# EAGLE design MJ818 clone - all driver - prod (EAGLE 9.6.2)
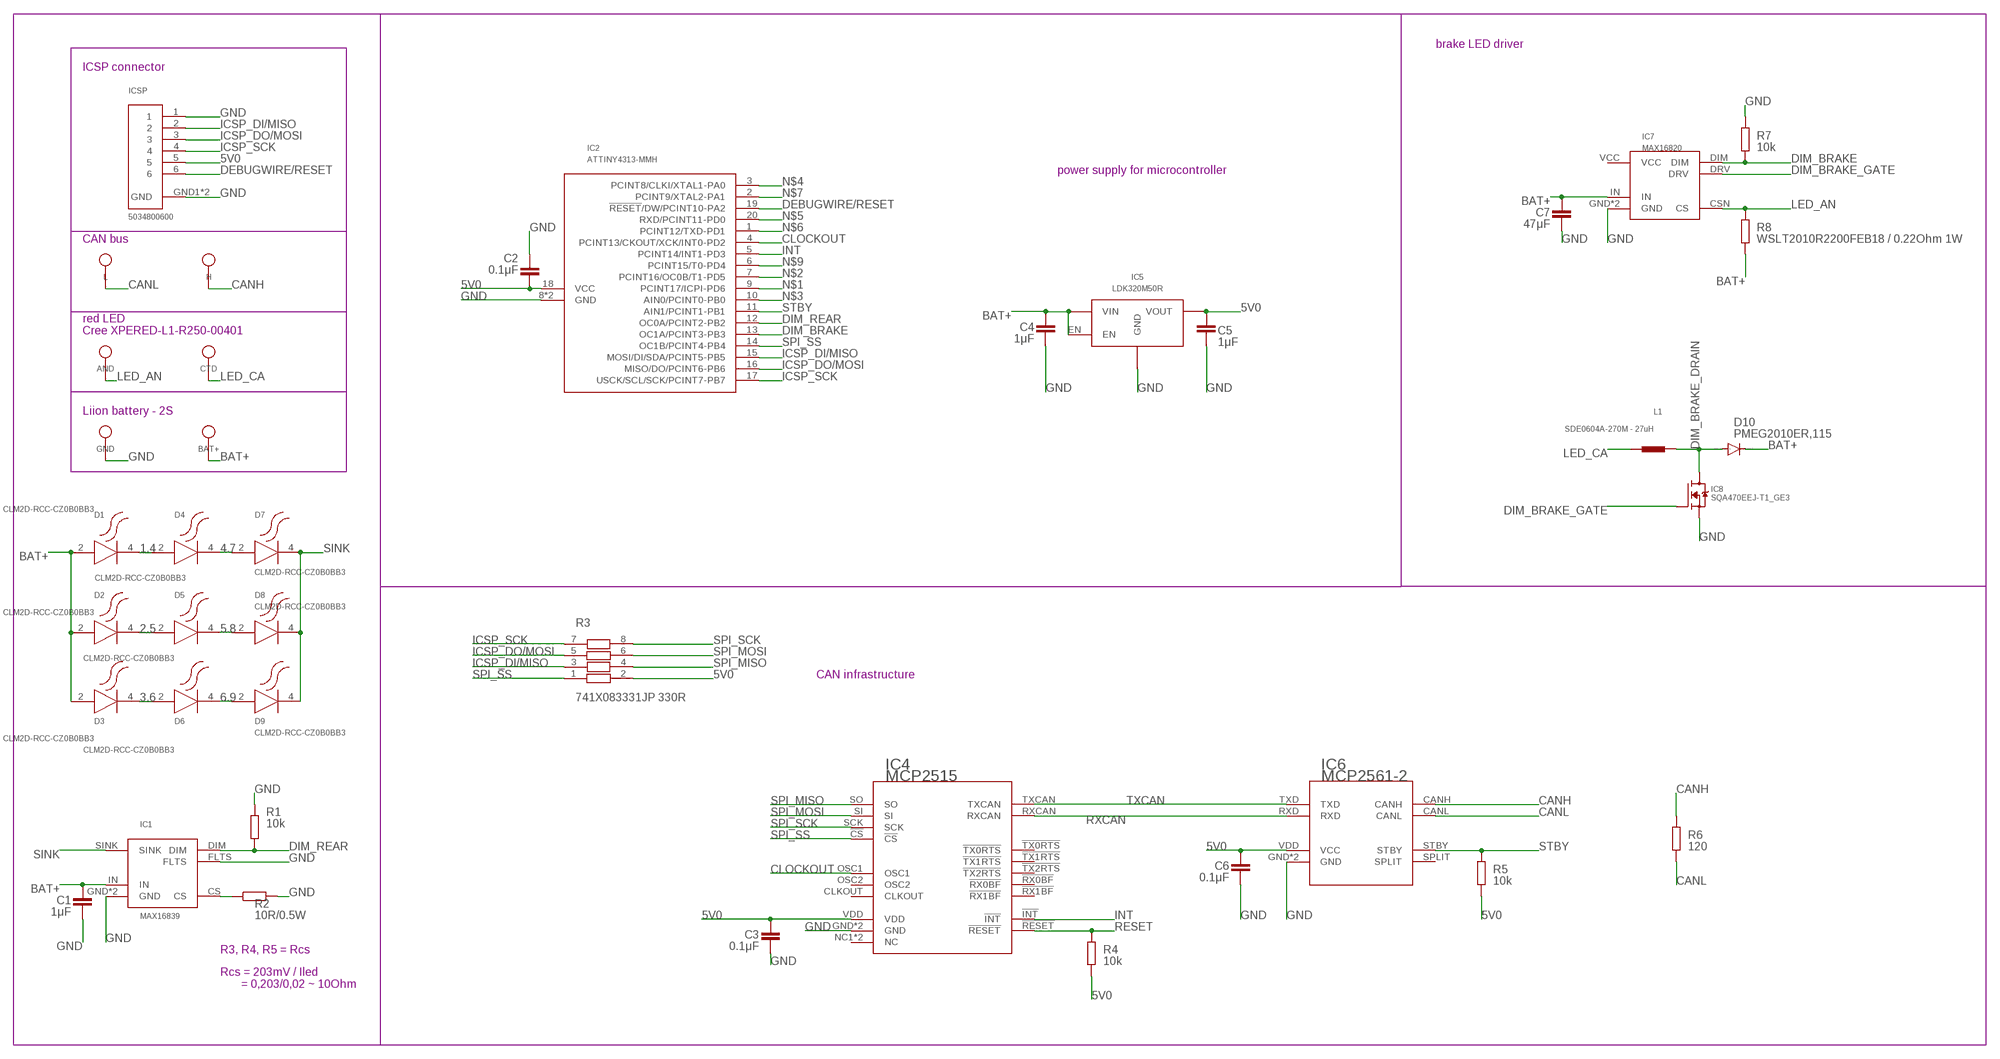
[diagram p0: schematic, sheet 1]

## Parts
AND  LED anode  TPSMT-1.2MM  [SMT-1.2MM]
BAT+  bat+  TPTH-1.2MM  [TH-1.2MM]
C1  1μF  C-EUC0402  [C0402]
C2  0.1μF  C-EUC0402  [C0402]
C3  0.1μF  C-EUC0402  [C0402]
C4  1μF  C-EUC0402  [C0402]
C5  1μF  C-EUC0402  [C0402]
C6  0.1μF  C-EUC0402  [C0402]
C7  47μF  C-EUC1206  [C1206]
CTD  LED cathode  TPSMT-1.2MM  [SMT-1.2MM]
D1  CLM2D-RCC-CZ0B0BB3  1374-CLM2D-RCC-ACC-1064252  [SMD]
D2  CLM2D-RCC-CZ0B0BB3  1374-CLM2D-RCC-ACC-1064252  [SMD]
D3  CLM2D-RCC-CZ0B0BB3  1374-CLM2D-RCC-ACC-1064252  [SMD]
D4  CLM2D-RCC-CZ0B0BB3  1374-CLM2D-RCC-ACC-1064252  [SMD]
D5  CLM2D-RCC-CZ0B0BB3  1374-CLM2D-RCC-ACC-1064252  [SMD]
D6  CLM2D-RCC-CZ0B0BB3  1374-CLM2D-RCC-ACC-1064252  [SMD]
D7  CLM2D-RCC-CZ0B0BB3  1374-CLM2D-RCC-ACC-1064252  [SMD]
D8  CLM2D-RCC-CZ0B0BB3  1374-CLM2D-RCC-ACC-1064252  [SMD]
D9  CLM2D-RCC-CZ0B0BB3  1374-CLM2D-RCC-ACC-1064252  [SMD]
D10  PMEG2010ER,115  DIODE-SOD123  [SOD123]
GND  gnd  TPTH-1.2MM  [TH-1.2MM]
H  LED anode  TPTH-1.2MM  [TH-1.2MM]
IC1  MAX16839  MAX16839  [TDFN-6-EP]
IC2  ATTINY4313-MMH  ATTINY4313VQFN-20  [VQFN-20]
IC4  MCP2515  MCP2515-I-ML  [QFN20]
IC5  LDK320M50R  LDK320SOT-23-5L  [SOT-23-5L]
IC6  MCP2561-2  [DFN10]
IC7  MAX16820  [TDFN-6-EP]
IC8  SQA470EEJ-T1_GE3  SIA456DJ  [SC-70-6]
ICSP  5034800600  [SMT]
L  LED anode  TPTH-1.2MM  [TH-1.2MM]
L1  SDE0604A-270M - 27uH  DE0604A-778075  [SMT]
R1  10k  R-EU_R0402  [R0402]
R2  10R/0.5W  R-EU_R0603  [R0603]
R3  741X083331JP 330R  741X083331JP  [0402]
R4  10k  R-EU_R0402  [R0402]
R5  10k  R-EU_R0402  [R0402]
R6  120  R-EU_R0805  [R0805]
R7  10k  R-EU_R0402  [R0402]
R8  WSLT2010R2200FEB18 / 0.22Ohm 1W  R-EU_R2010  [R2010]

## Nets
1.4 [currett-0.25mA]: D1.4(C) D4.2(A)
2.5 [currett-0.25mA]: D2.4(C) D5.2(A)
3.6 [currett-0.25mA]: D3.4(C) D6.2(A)
4.7 [currett-0.25mA]: D4.4(C) D7.2(A)
5.8 [currett-0.25mA]: D5.4(C) D8.2(A)
5V0 [VCC]: C2.1 C3.1 C5.2 C6.1 IC2.18(VCC) IC4.VDD IC5.OUT(VOUT) IC6.VDD(VCC) ICSP.5 R3.2 R4.1 R5.1
6.9 [currett-0.25mA]: D6.4(C) D9.2(A)
BAT+ [currett-0.25mA]: BAT+.TP$1 C1.2 C4.1 C7.1 D1.2(A) D2.2(A) D3.2(A) D10.C IC1.IN IC5.EN IC5.IN(VIN) IC7.IN R8.2
CANH [signal]: H.TP$1 IC6.CANH R6.2
CANL [signal]: IC6.CANL L.TP$1 R6.1
CLOCKOUT [signal_internal]: IC2.4(PCINT13/CKOUT/XCK/INT0-PD2) IC4.OSC1
CS [signal]: IC1.CS R2.1
DEBUGWIRE/RESET [signal]: IC2.19(!RESET!/DW/PCINT10-PA2) ICSP.6
DIM_BRAKE [signal]: IC2.13(OC1A/PCINT3-PB3) IC7.DIM R7.1
DIM_BRAKE_DRAIN: D10.A IC8.1D(D) IC8.2D(D) IC8.5D(D) IC8.6D(D) IC8.D L1.P$2
DIM_BRAKE_GATE [signal]: IC7.DRV IC8.3G(G)
DIM_REAR [signal_internal]: IC1.DIM IC2.12(OC0A/PCINT2-PB2) R1.1
GND: C1.1 C2.2 C3.2 C4.2 C5.1 C6.2 C7.2 GND.TP$1 IC1.FLTS IC1.GND IC1.GND1(GND) IC2.8(GND) IC2.GND IC4.GND IC4.GND6(GND) IC5.GND IC6.GND IC6.VSS(GND) IC7.GND IC7.GND1(GND) IC8.4S(S) IC8.S ICSP.1 ICSP.GND1(GND) ICSP.GND2(GND) R1.2 R2.2 R7.2
ICSP_DI/MISO [signal]: IC2.15(MOSI/DI/SDA/PCINT5-PB5) ICSP.2 R3.3
ICSP_DO/MOSI [signal]: IC2.16(MISO/DO/PCINT6-PB6) ICSP.3 R3.5
ICSP_SCK [signal]: IC2.17(USCK/SCL/SCK/PCINT7-PB7) ICSP.4 R3.7
INT [signal_internal]: IC2.5(PCINT14/INT1-PD3) IC4.!INT!
LED_AN [currett-0.25mA]: AND.P$1(TP$1) IC7.CSN(CS) R8.1
LED_CA: CTD.P$1(TP$1) L1.P$1
N$1: IC2.9(PCINT17/ICPI-PD6)
N$2: IC2.7(PCINT16/OC0B/T1-PD5)
N$3: IC2.10(AIN0/PCINT0-PB0)
N$4: IC2.3(PCINT8/CLKI/XTAL1-PA0)
N$5: IC2.20(RXD/PCINT11-PD0)
N$6: IC2.1(PCINT12/TXD-PD1)
N$7: IC2.2(PCINT9/XTAL2-PA1)
N$9: IC2.6(PCINT15/T0-PD4)
RESET [signal]: IC4.!RESET! R4.2
RXCAN [signal_internal]: IC4.RXCAN IC6.RXD
SINK [signal_internal]: D7.4(C) D8.4(C) D9.4(C) IC1.SINK
SPI_MISO [signal]: IC4.SO R3.4
SPI_MOSI [signal]: IC4.SI R3.6
SPI_SCK [signal]: IC4.SCK R3.8
SPI_SS [signal]: IC2.14(OC1B/PCINT4-PB4) IC4.!CS! R3.1
STBY [signal_internal]: IC2.11(AIN1/PCINT1-PB1) IC6.STBY R5.2
TXCAN [signal]: IC4.TXCAN IC6.TXD
Unconnected: IC4.!RX0BF! IC4.!RX1BF! IC4.!TX0RTS! IC4.!TX1RTS! IC4.!TX2RTS! IC4.CLKOUT IC4.NC1(NC) IC4.NC2(NC) IC4.OSC2 IC6.SPLIT

## Notes on the sheet
- brake LED driver
- ICSP connector
- power supply for microcontroller
- CAN bus
- red LED
  Cree XPERED-L1-R250-00401
- Liion battery - 2S
- CAN infrastructure
- R3, R4, R5 = Rcs
- Rcs = 203mV / Iled
         = 0,203/0,02 ~ 10Ohm

## Power pins joined to a net without a drawn wire
VCC: IC7.VCC

## Library data of the parts
AND BAT+ CTD GND H L = signal testpoint:TP
C1-C7 = rcl:C-EU: CAPACITOR, European symbol; SPICEPREFIX: C
D1-D9 = 1374-CLM2D-RCC-ACC-1064252 - Red SMD LED:1374-CLM2D-RCC-ACC-1064252
D10 = diode:DIODE-: DIODE
IC1 = MAX16839 LED Driver, constant current:MAX16839
IC2 = ATtiny4313 microcontroller:ATTINY4313; SPICEPREFIX: X
IC4 = MCP2515-I-ML - Standalonce CAN Controller with SPI Interface:MCP2515-I-ML
IC5 = LDK320 5V LDO:LDK320
IC6 = MCP2561-2 - High-Speed CAN Transceiver:MCP2561-2
IC7 = MAX16820 LED Driver, constant current:MAX16820
IC8 = SIA456DJ-T1-GE3  N-Fet:SIA456DJ
ICSP = 5034800600 FPC Connector:5034800600
L1 = DE0604A-778075 - Inductor:DE0604A-778075
R1 R2 R4-R8 = rcl:R-EU_: RESISTOR, European symbol; SPICEPREFIX: R
R3 = 74x-1133528 Resistor Array:741X083331JP

## Net classes
0 GND: width 0.5 mm, drill 0.35 mm, clearance 0.2 mm
1 VCC: width 0.5 mm, drill 0.35 mm, clearance 0.2 mm
2 signal: width 0.2 mm, drill 0.35 mm, clearance 0.19 mm
3 5V0CAN: width 0.25 mm, drill 0.35 mm, clearance 0.2 mm
4 5V0_μC: width 0.25 mm, drill 0.35 mm, clearance 0.2 mm
5 currett-0.25mA: width 0.25 mm, drill 0.35 mm, clearance 0.2 mm
6 signal_internal: width 0.4 mm, drill 0.35 mm, clearance 0.19 mm

## Board
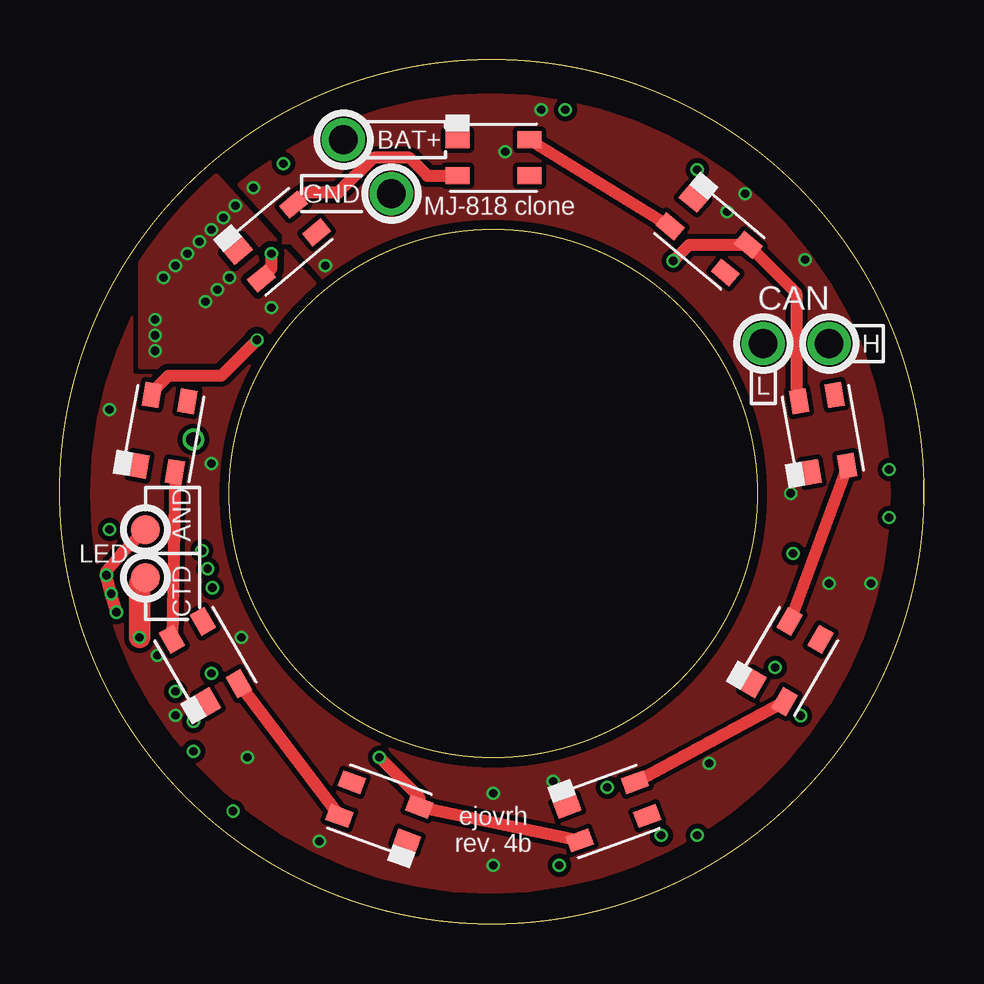
[diagram p1: board, top side]
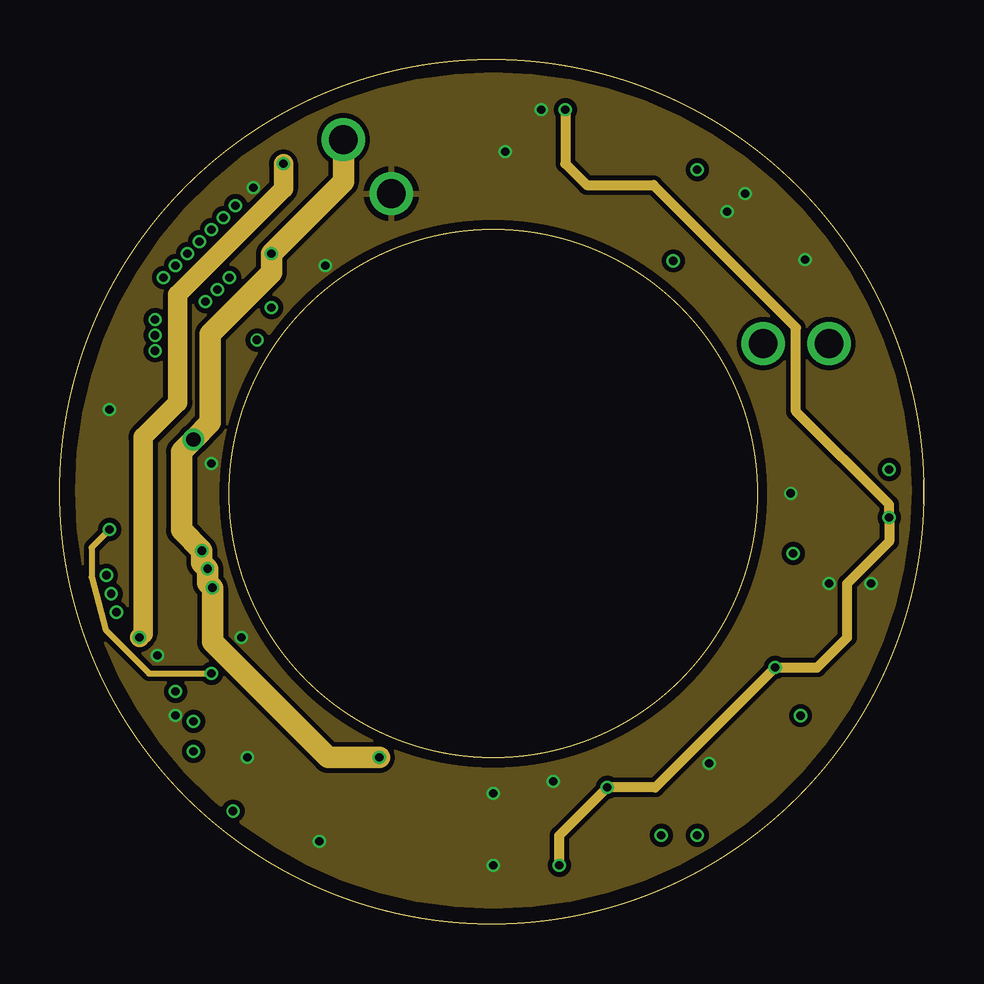
[diagram p2: board, inner layer Route2]
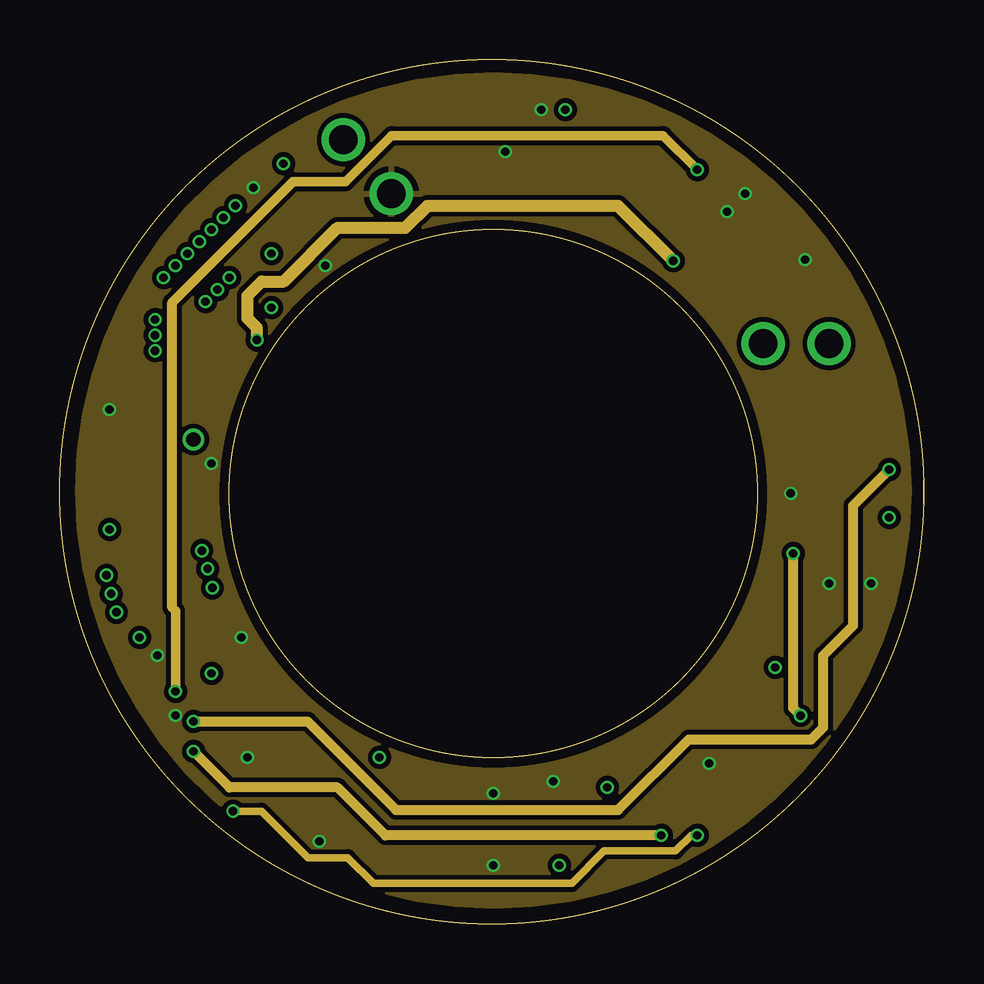
[diagram p3: board, inner layer Route15]
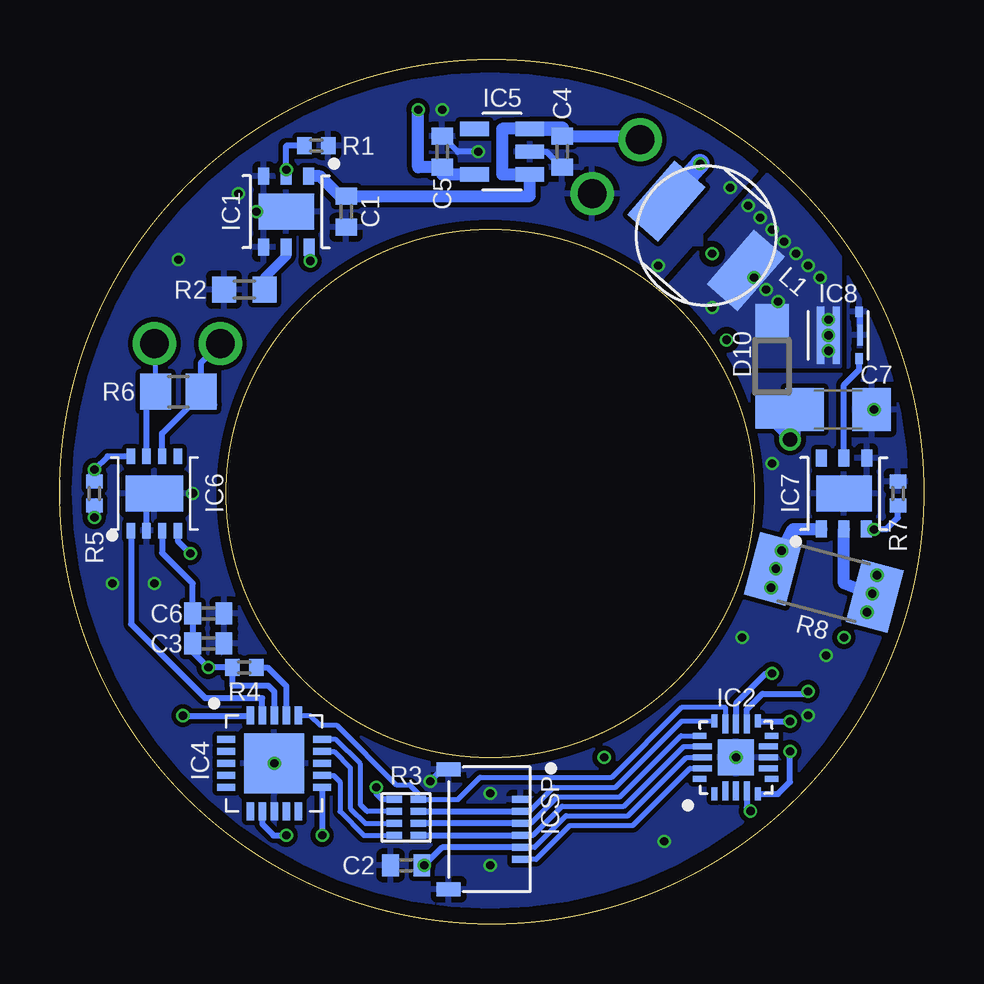
[diagram p4: board, bottom side, seen from below]

Size 36 x 36 mm. Coordinates in mm from the lower left corner, seen from the top.
Outline: 36,17.5 36,18.5
Outline: circle at 18,18 radius 18
Outline: circle at 18.07,17.93 radius 11
Copper layers (1*2*15*16): Top 0.035559375mm / dielectric 0.17018125mm / Route2 0.01778125mm / dielectric 47mil / Route15 0.01778125mm / dielectric 0.17018125mm / Bottom 0.035559375mm
Design rules "oshpark-4layer": minimum track width 5mil, minimum drill 10mil, track to track 5mil, track to pad 5mil, pad to pad 5mil, via to via 5mil, smd to smd 5mil, copper to edge 15mil, drill to drill 6mil, minimum pad ring 4mil, minimum via ring 4mil, stop-mask expansion 1.5mil, vias tented up to drill 0mil, thermal gap 10mil
tKeepout: 4 lines
bKeepout: 4 lines

### Footprints (pad centres in the part's own frame; a part is rotated, then mirrored left to right if it is on the bottom)
SMT-1.2MM = smd 1.2 x 1.2: P$1 0,0
TH-1.2MM = drill 1.2 pad 1.8: TP$1 0,0
C0402 = smd 0.7 x 0.9: 1 -0.65,0; 2 0.65,0
C1206 = smd 1.6 x 1.8: 1 -1.4,0; 2 1.4,0
SMD = smd 1 x 0.7: 1 -1.5,0.75; 2 -1.5,-0.75; 3 1.5,-0.75; 4 1.5,0.75
SOD123 = smd 1.4 x 1.4: A 1.9,0; C -1.9,0
TDFN-6-EP = smd 0.71 x 0.46: CS 1.48,0; DIM -1.48,0; FLTS -1.48,-0.94; GND1 1.48,-0.95; IN -1.48,0.94; SINK 1.48,0.95 | smd 1.5 x 2.3: GND 0,0
VQFN-20 = smd 0.55 x 0.25: 1 -1.52,0.9; 5 -1.52,-0.9; 11 1.52,-0.9; 15 1.52,0.9 | smd 0.8 x 0.25: 2 -1.4,0.45; 3 -1.4,0; 4 -1.4,-0.45; 12 1.4,-0.45; 13 1.4,0; 14 1.4,0.45 | smd 0.25 x 0.55: 6 -0.9,-1.48; 10 0.9,-1.48; 16 0.9,1.52; 20 -0.9,1.52 | smd 0.25 x 0.8: 7 -0.45,-1.35; 8 0,-1.35; 9 0.45,-1.35; 17 0.45,1.4; 18 0,1.4; 19 -0.45,1.4 | smd 1.5 x 1.5: GND 0,0
QFN20 = smd 0.3 x 0.75: !CS! 1,2; !RESET! 0.5,2; !RX0BF! 1,-2; !RX1BF! 0.5,-2; GND6 0,-2; OSC1 -0.5,-2; OSC2 -1,-2; RXCAN -1,2; TXCAN -0.5,2; VDD 0,2 | smd 0.75 x 0.3: !INT! 2,-1; !TX0RTS! -2,0.5; !TX1RTS! -2,0; !TX2RTS! -2,-1; CLKOUT -2,1; NC1 -2,-0.5; NC2 2,0; SCK 2,-0.5; SI 2,0.5; SO 2,1 | smd 2.5 x 2.5: GND 0,0
SOT-23-5L = smd 0.6 x 1.2: ADJ/NC -0.95,-1.15; EN -0.95,1.15; GND 0,1.15; IN 0.95,1.15; OUT 0.95,-1.15
DFN10 = smd 0.35 x 0.65: CANH -0.325,1.55; CANL 0.325,1.55; RXD 0.975,-1.55; SPLIT 0.975,1.55; STBY -0.975,1.55; TXD -0.975,-1.55; VDD 0.325,-1.55; VSS -0.325,-1.55 | smd 2.4 x 1.5: GND 0,0
TDFN-6-EP' = smd 0.71 x 0.46: CSN -1.48,0; DIM -1.48,-0.94; DRV 1.48,0; GND1 1.48,-0.95; IN -1.48,0.94; VCC 1.48,0.95 | smd 1.5 x 2.3: GND 0,0
SC-70-6 = smd 0.45 x 0.3: 1D -0.975,0.725; 2D -0.975,0.075; 3G -0.975,-0.88; 4S 0.975,-0.88; 5D 0.975,0.075; 6D 0.975,0.725 | smd 1.5 x 0.95: D 0,0.4 | smd 0.87 x 0.23: S 0,-0.915
SMT = smd 0.3 x 0.7: 1 -1.25,1.27; 2 -0.75,1.27; 3 -0.25,1.27; 4 0.25,1.27; 5 0.75,1.27; 6 1.25,1.27 | smd 0.6 x 1: GND1 -2.5,-1.73; GND2 2.5,-1.73
SMT' = smd 1.7 x 3: P$1 2.2,0; P$2 -2.2,0
R0402 = smd 0.6 x 0.7: 1 -0.5,0; 2 0.5,0
R0603 = smd 1 x 1.1: 1 -0.85,0; 2 0.85,0
0402 = smd 0.65 x 0.3: 1 -0.5,-0.75; 2 0.5,-0.75; 3 -0.5,-0.25; 4 0.5,-0.25; 5 -0.5,0.25; 6 0.5,0.25; 7 -0.5,0.75; 8 0.5,0.75
R0805 = smd 1.3 x 1.5: 1 -0.95,0; 2 0.95,0
R2010 = smd 1.8 x 2.7: 1 -2.2,0; 2 2.2,0

### Placement (x,y rotation side)
AND  3.57,16.43 0 top
BAT+  11.82,32.68 0 top
C1  24.07,29.68 90 bottom
C2  21.57,2.43 180 bottom
C3  29.82,11.68 0 bottom
C4  15.07,32.18 270 bottom
C5  20.07,32.18 270 bottom
C6  29.82,12.93 0 bottom
C7  3.57,21.43 0 bottom
CTD  3.57,14.43 0 top
D1  22.82,4.68 20 top
D2  13.32,4.68 160 top
D3  9.07,28.43 40 top
D4  30.32,10.93 60 top
D5  6.07,10.93 120 top
D6  18.07,31.93 0 top
D7  31.82,20.43 100 top
D8  4.32,20.43 80 top
D9  27.07,28.68 320 top
D10  6.32,23.23 90 bottom
GND  13.82,30.43 0 top
H  32.07,24.18 0 top
IC1  26.57,29.68 270 bottom
IC2  7.82,6.93 90 bottom
IC4  27.07,6.68 0 bottom
IC5  17.57,32.18 270 bottom
IC6  32.07,17.93 0 bottom
IC7  MAX16820  [TDFN-6-EP']  3.32,17.93 90 bottom
IC8  3.57,24.53 90 bottom
ICSP  18.07,3.93 270 bottom
L  29.32,24.18 0 top
L1  SDE0604A-270M - 27uH  [SMT']  9.07,28.68 138.9 bottom
R1  25.32,32.43 0 bottom
R2  28.32,26.43 180 bottom
R3  21.57,4.43 180 bottom
R4  28.32,10.68 0 bottom
R5  34.57,17.93 90 bottom
R6  31.07,22.18 180 bottom
R7  1.07,17.93 90 bottom
R8  4.16,14.22 165.1 bottom

### Tracks (layer width: path | path; a pad name or v marks a point on that pad's centre or on a via)
1.4
  Top 0.508: D1.4 D4.2
2.5
  Top 0.508: D2.4 D5.2
3.6
  Top 0.508: D3.4 10.23,30.47 11.6,30.47 13.06,31.93 14.57,31.93 15.32,31.18 D6.2
4.7
  Top 0.508: D7.2 D4.4
5.8
  Top 0.508: D8.2 D5.4
5V0  (via drill 0.35)
  Route2 0.406: v20.82,2.43 20.82,3.68 v22.82,5.68 24.82,5.68 v29.82,10.68 31.57,10.68 32.82,11.93 32.82,14.18 34.57,15.93 v34.57,16.93 34.57,17.47 30.69,21.35 30.69,24.84 24.75,30.78 21.96,30.78 21.07,31.68 v21.07,33.93
  Bottom 0.2: IC2.18 9.88,6.93 12.31,4.49 14.9,4.49 16.22,3.18 ICSP.5
  Bottom 0.254: IC4.VDD 27.07,9.68 27.32,9.93 28.82,9.93 R4.1 v29.82,10.68 30.47,11.33 C3.1 C6.1 30.47,14.18 31.74,15.45 IC6.VDD | C2.1 v20.82,2.43 20.07,3.18 ICSP.5 | v22.82,5.68 22.82,5.43 22.57,5.18 R3.2
  Bottom 0.508: IC5.OUT 20.07,31.23 C5.2 21.07,31.53 v21.07,33.93 | R5.1 v34.57,16.93
6.9
  Top 0.508: D6.4 D9.2
BAT+  (via drill 0.35, 0.6)
  Top 0.508: D1.2 D2.2 14.98,5.26 v13.32,6.93 | D3.2 8.82,27.3 v8.82,27.93
  Route2 0.9: BAT+.TP$1 11.82,30.93 v8.82,27.93 8.82,27.13 6.27,24.58 6.27,20.88 v5.57,20.18 5.07,19.68 5.07,16.4 v5.92,15.55 5.92,15.03 v6.16,14.79 6.16,14.2 v6.36,14 6.36,11.75 11.18,6.93 v13.32,6.93
  Bottom 0.5: C4.1 11.97,32.83 BAT+.TP$1
  Bottom 0.508: IC5.EN 17.57,33.13 17.57,31.23 IC5.IN 16.42,30.33 C1.2 24.32,30.33 25.15,31.16 IC1.IN | v6.16,14.79 6.2,14.83 R8.2 | R8.2 6.12,14.69 6.12,15.35 v5.92,15.55 | R8.2 5.44,16.45 IC7.IN
  Bottom 0.61: IC5.EN 15.07,33.13 C4.1
  Bottom 0.9: v5.57,20.18 5.57,20.58 | 5.57,20.58 5.57,21.78 5.32,21.78 C7.1 | 5.57,20.58 D10.C
CANH
  Bottom 0.2: R6.2 32.02,24.13 H.TP$1
  Bottom 0.254: IC6.CANH 32.39,21.8 R6.2 32.07,22.23
CANL
  Bottom 0.25: R6.1 30.12,23.38 L.TP$1
  Bottom 0.254: IC6.CANL 31.74,20.44 30.12,22.06 R6.1 29.57,21.63
CLOCKOUT  (via drill 0.35)
  Route15 0.305: v26.57,3.68 26.32,3.68 25.67,3.03 22.69,3.03 21.34,1.68 13.07,1.68 12,2.75 10.34,2.75 8.4,4.69 v7.22,4.69
  Bottom 0.254: IC2.4 7.37,4.84 v7.22,4.69 | IC4.OSC1 27.57,4.15 27.1,3.68 v26.57,3.68
CS
  Bottom 0.406: IC1.CS 26.57,27.83 27.47,26.93 R2.1
DEBUGWIRE/RESET
  Bottom 0.2: IC2.19 9.73,6.48 12.12,4.09 14.74,4.09 16.15,2.68 ICSP.6
DIM_BRAKE  (via drill 0.35)
  Route2 0.254: v2.07,16.43 1.32,15.68 1.32,14.45 1.91,12.23 3.72,10.43 v6.32,10.43
  Bottom 0.254: R7.1 1.07,16.93 1.55,16.45 IC7.DIM 2.36,16.43 v2.07,16.43 | IC2.13 7.82,9.18 6.57,10.43 v6.32,10.43
DIM_BRAKE_DRAIN  (via drill 0.35)
  other vias: 3.97,24.53 3.97,23.88 3.97,25.18 6.32,28.93 7.07,26.93 8.82,25.68 6.57,26.43 5.82,28.43 5.32,27.93 4.82,27.43 4.32,26.93 6.82,29.43 7.32,29.93 6.07,25.93
  pour Bottom (isolate 0.254, rank 2, no thermals): 3.47,23.23 13.61,23.23 3.47,34.71
  pour Top (isolate 0.254, rank 2, no thermals): 3.32,23.18 13.83,23.18 4.07,33.93 3.32,33.93
DIM_BRAKE_GATE
  Bottom 0.254: IC8.3G 2.69,23.08 3.32,22.45 IC7.DRV
DIM_REAR  (via drill 0.35)
  Route15 0.4: 9.72,30.93 11.9,30.93 13.83,32.85 25.14,32.85 v26.57,31.43 | v4.82,9.68 4.82,13.04 4.68,13.18
  Route15 0.406: 4.68,13.18 4.68,25.89 9.72,30.93
  Bottom 0.254: IC1.DIM v26.57,31.43 26.57,32.43 R1.1 | v4.82,9.68 4.91,9.58 6.71,9.58 7.37,8.93 IC2.12
GND  (via drill 0.35)
  Bottom 0.25: IC8.S 2.65,25.47 IC8.4S
  Bottom 0.254: IC6.VSS 32.39,17.93 IC6.GND | ICSP.GND1 20.07,6.43 v20.57,5.93 | IC5.GND 15.72,32.18 C4.2 | v18.57,32.18 19.42,32.18 C5.1
  other vias: 27.82,29.68 32.07,14.18 18.07,2.43 27.07,6.68 10.82,3.43 4.82,8.68 18.07,5.43 30.46,17.93 31.07,27.68 7.82,6.93 33.82,14.18 4.07,11.18 20.07,33.93 7.57,11.93 28.57,30.43 8.07,30.68 11.07,27.43 6.32,19.18 2.07,21.43
  pour Bottom (rank 3): 35.44,18.05 arc90 18.07,35.43 arc90 0.69,18.05 arc90 18.07,0.68 arc90
  pour Top (rank 3): 17.94,34.55 arc-90 34.57,17.93 arc-90 17.94,1.3 arc-90 1.32,17.93 arc-90
  pour Route2: 0.69,18.05 arc90 18.07,0.68 arc90 35.44,18.05 arc90 18.07,35.43 arc90
  pour Route15: 0.69,18.05 arc90 18.07,0.68 arc90 35.44,18.05 arc90 18.07,35.43 arc90
ICSP_DI/MISO
  Bottom 0.2: IC2.15 10.08,8.45 12.84,5.69 15.43,5.69 16.44,4.68 ICSP.2
  Bottom 0.254: R3.3 ICSP.2
ICSP_DO/MOSI
  Bottom 0.2: IC2.16 10.11,7.83 12.65,5.28 15.26,5.28 16.37,4.18 ICSP.3
  Bottom 0.254: ICSP.3 R3.5
ICSP_SCK
  Bottom 0.2: IC2.17 10,7.38 12.48,4.89 15.07,4.89 16.29,3.68 ICSP.4
  Bottom 0.254: R3.7 ICSP.4
INT  (via drill 0.35)
  Route15 0.406: v5.57,7.18 7.07,5.68 11.57,5.68 13.57,3.68 v25.07,3.68
  Bottom 0.254: IC4.!INT! v25.07,3.68 | IC2.5 6.07,5.41 5.57,5.91 v5.57,7.18
LED_AN  (via drill 0.35)
  Top 0.508: v2.36,12.98 v2.14,13.75 v1.94,14.52 1.94,14.68 2.61,15.47 AND.P$1
  Bottom 0.508: v1.94,14.52 1.94,13.74 R8.1 | R8.1 3.32,14.18 IC7.CSN | v2.14,13.75 2.08,13.72 R8.1
LED_CA  (via drill 0.35)
  Top 0.9: CTD.P$1 3.32,14.18 v3.32,11.93
  Route2 0.813: v9.32,31.68 9.32,30.63 4.92,26.23 4.92,21.73 3.47,20.28 3.47,12.08 v3.32,11.93
  Bottom 0.813: L1.P$1 10.47,30.37 v9.32,31.68
RESET
  Bottom 0.254: IC4.!RESET! 26.57,9.9 27.35,10.68 R4.2
RXCAN  (via drill 0.35)
  Route15 0.406: v30.88,8.67 30.57,8.98 v30.57,15.43
  Bottom 0.254: IC6.RXD 31.09,15.95 v30.57,15.43 | v30.88,8.67 IC4.RXCAN
SINK  (via drill 0.35)
  Top 0.508: D7.4 30.7,21.89 30.7,26.29 D9.4 26.23,28.29 v25.57,27.63 | D8.4 3.84,22.15 4.52,22.83 6.72,22.83 v8.22,24.33
  Route15 0.5: 8.22,24.83 7.82,25.23 7.82,26.18 8.41,26.77 9.34,26.77 11.57,29 14.39,29 15.32,29.93 23.27,29.93 v25.57,27.63
  Route15 0.508: v8.22,24.33 8.22,24.83
  Bottom 0.406: v25.57,27.63 25.62,27.68 IC1.SINK
SPI_MISO
  Bottom 0.2: R3.4 23.2,4.68 23.48,4.96 23.48,6.65 24.5,7.68 IC4.SO
SPI_MOSI
  Bottom 0.2: IC4.SI 24.58,7.18 23.9,6.49 23.9,4.81 23.27,4.18 R3.6
SPI_SCK
  Bottom 0.2: IC4.SCK 24.59,6.18 24.33,5.91 24.33,4.67 23.33,3.68 R3.8
SPI_SS
  Bottom 0.2: IC2.14 8.27,9.03 10.07,9.03 13,6.1 18.49,6.1 19.41,5.18 R3.1 21.07,5.43 21.42,5.78 21.98,5.78 24.47,8.27 25.16,8.27 25.57,8.68 IC4.!CS!
STBY  (via drill 0.35)
  Route15 0.406: v5.57,8.43 10.32,8.43 14.01,4.73 23.27,4.73 26.21,7.68 31.32,7.68 31.82,8.18 31.82,11.18 33.07,12.43 33.07,17.43 v34.57,18.93
  Bottom 0.254: IC2.11 6.9,8.43 v5.57,8.43 | IC6.STBY 34.02,19.48 v34.57,18.93
  Bottom 0.508: R5.2 v34.57,18.93
TXCAN
  Bottom 0.254: IC4.TXCAN 27.57,9.4 29.95,9.4 33.04,12.48 IC6.TXD

### Text on the board
tPlace: MJ-818 clone | CAN | H | L | LED | ejovrh / rev. 4b
tNames: BAT+ | GND